# EAGLE design 2 (EAGLE 6.5.0)
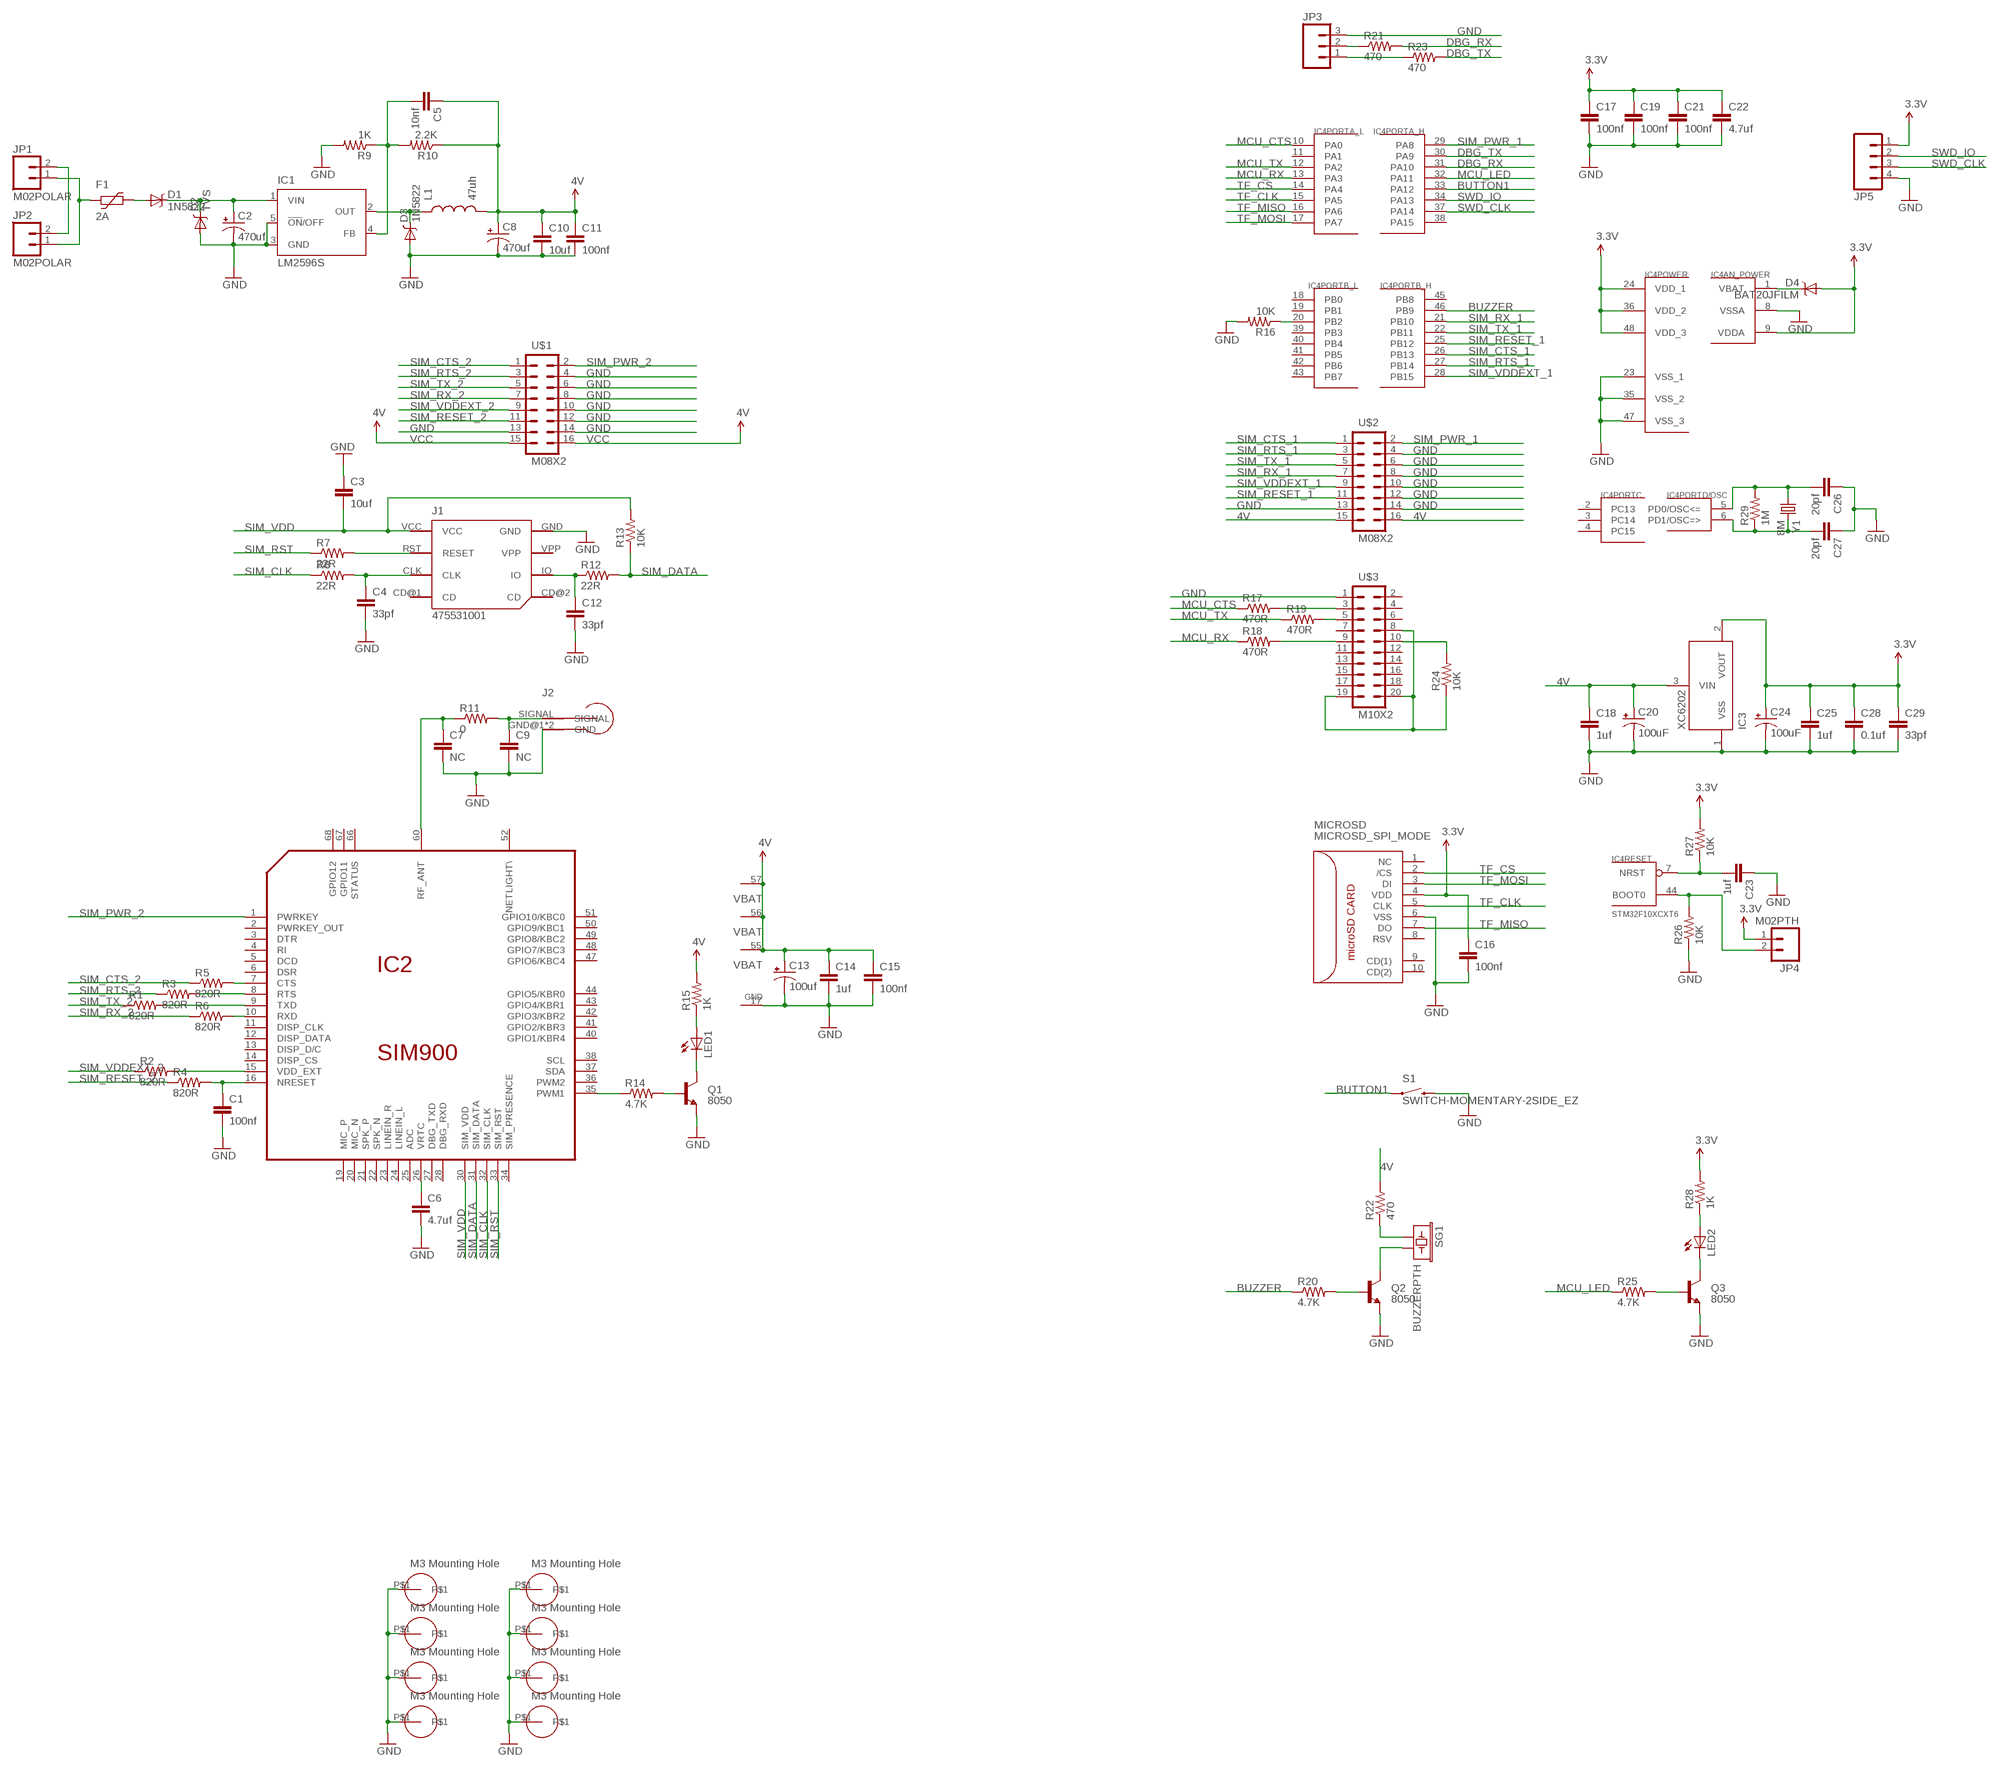
[diagram p0: schematic, sheet 1]

## Parts
C1  100nf  CAP0603-CAP  [0603-CAP]
C2  470uf  CAP_POLPTH4  [CPOL-RADIAL-1000UF-25V]
C3  10uf  CAP0603-CAP  [0603-CAP]
C4  33pf  CAP0603-CAP  [0603-CAP]
C5  10nf  CAP0603-CAP  [0603-CAP]
C6  4.7uf  CAP0603-CAP  [0603-CAP]
C7  NC  CAP0603-CAP  [0603-CAP]
C8  470uf  CAP_POLG  [PANASONIC_G]
C9  NC  CAP0603-CAP  [0603-CAP]
C10  10uf  CAP0603-CAP  [0603-CAP]
C11  100nf  CAP0603-CAP  [0603-CAP]
C12  33pf  CAP0603-CAP  [0603-CAP]
C13  100uf  CAP_POL6032  [EIA6032]
C14  1uf  CAP0603-CAP  [0603-CAP]
C15  100nf  CAP0603-CAP  [0603-CAP]
C16  100nf  CAP0603-CAP  [0603-CAP]
C17  100nf  CAP0603-CAP  [0603-CAP]
C18  1uf  CAP0603-CAP  [0603-CAP]
C19  100nf  CAP0603-CAP  [0603-CAP]
C20  100uF  10UF-20V-10%(TANT)  [EIA3528]
C21  100nf  CAP0603-CAP  [0603-CAP]
C22  4.7uf  CAP0603-CAP  [0603-CAP]
C23  1uf  CAP0603-CAP  [0603-CAP]
C24  100uF  10UF-20V-10%(TANT)  [EIA3528]
C25  1uf  CAP0603-CAP  [0603-CAP]
C26  20pf  CAP0603-CAP  [0603-CAP]
C27  20pf  CAP0603-CAP  [0603-CAP]
C28  0.1uf  CAP0603-CAP  [0603-CAP]
C29  33pf  CAP0603-CAP  [0603-CAP]
D1  1N5822  DIODE-SCHOTTKT-SMB  [SMB-DIODE]
D2  TVS  TVS_SMB  [SMB-DIODE]
D3  1N5822  DIODE-SCHOTTKT-SMB  [SMB-DIODE]
D4  BAT20JFILM  [SOD-323]
F1  2A  PTC-FUSE1812L  [1812L]
IC1  LM2596S  [TO263-5]
IC2  SIM900  [SIM900]
IC3  XC6202  XC6206  [SOT23-3]
IC4  STM32F10XCXT6  [TQFP48]
J1  475531001  [475531001]
J2  IPEX  [IPEX]
JP1  M02POLAR  [MOLEX-1X2]
JP2  M02POLAR  [MOLEX-1X2]
JP3  M03PTH  [1X03]
JP4  M02PTH  [1X02]
JP5  M04PTH  [1X04]
L1  47uh  IHLP4040DZ  [IHLP4040DZ]
LED1  LEDSML0805  [SML0805]
LED2  LED3MM  [LED3MM]
MICROSD  MICROSD_SPI_MODE  [MICRO_SD_CONNECTOR]
Q1  8050  TRANSISTOR_NPNSOT23  [SOT23]
Q2  8050  TRANSISTOR_NPNSOT23  [SOT23]
Q3  8050  TRANSISTOR_NPNSOT23  [SOT23]
R1  820R  RESISTOR0603-RES  [0603-RES]
R2  820R  RESISTOR0603-RES  [0603-RES]
R3  820R  RESISTOR0603-RES  [0603-RES]
R4  820R  RESISTOR0603-RES  [0603-RES]
R5  820R  RESISTOR0603-RES  [0603-RES]
R6  820R  RESISTOR0603-RES  [0603-RES]
R7  22R  1M-1%  [0603-RES]
R8  22R  1M-1%  [0603-RES]
R9  1K  RESISTOR0603-RES  [0603-RES]
R10  2.2K  RESISTOR0603-RES  [0603-RES]
R11  0  1M-1%  [0603-RES]
R12  22R  1M-1%  [0603-RES]
R13  10K  1M-1%  [0603-RES]
R14  4.7K  1M-1%  [0603-RES]
R15  1K  RESISTOR0603-RES  [0603-RES]
R16  10K  1M-1%  [0603-RES]
R17  470R  1M-1%  [0603-RES]
R18  470R  1M-1%  [0603-RES]
R19  470R  1M-1%  [0603-RES]
R20  4.7K  1M-1%  [0603-RES]
R21  470  1M-1%  [0603-RES]
R22  470  1M-1%  [0603-RES]
R23  470  1M-1%  [0603-RES]
R24  10K  1M-1%  [0603-RES]
R25  4.7K  1M-1%  [0603-RES]
R26  10K  RESISTOR0603-RES  [0603-RES]
R27  10K  RESISTOR0603-RES  [0603-RES]
R28  1K  1M-1%  [0603-RES]
R29  1M  1M-1%  [0603-RES]
S1  SWITCH-MOMENTARY-2SIDE_EZ  [TACTILE-PTH-SIDEEZ]
SG1  BUZZERPTH  [BUZZER-12MM]
U$1  M08X2  [2X8]
U$2  M08X2  [2X8]
U$3  M10X2  [2X10]
U$4  M3_MOUNTING_HOLE  [M3_MOUNTING_HOLE]
U$5  M3_MOUNTING_HOLE  [M3_MOUNTING_HOLE]
U$6  M3_MOUNTING_HOLE  [M3_MOUNTING_HOLE]
U$7  M3_MOUNTING_HOLE  [M3_MOUNTING_HOLE]
U$8  M3_MOUNTING_HOLE  [M3_MOUNTING_HOLE]
U$9  M3_MOUNTING_HOLE  [M3_MOUNTING_HOLE]
U$10  M3_MOUNTING_HOLE  [M3_MOUNTING_HOLE]
U$11  M3_MOUNTING_HOLE  [M3_MOUNTING_HOLE]
Y1  8M  CRYSTALHC49US  [HC49US]

## Nets
3.3V: C16.1 C17.1 C19.1 C21.1 C22.1 C24.A(+) C25.1 C28.1 C29.1 D4.2(A) IC3.2(VOUT) IC4.9(AN_POWER:VDDA) IC4.24(POWER:VDD_1) IC4.36(POWER:VDD_2) IC4.48(POWER:VDD_3) JP4.1 JP5.1 MICROSD.4(VDD) R27.2 R28.2
4V: C18.1 C20.A(+) IC3.3(VIN) R22.2 U$2.15 U$2.16
BUTTON1: IC4.33(PORTA_H:PA12) S1.1
BUZZER: IC4.46(PORTB_H:PB9) R20.1
DBG_RX: IC4.31(PORTA_H:PA10) R21.2
DBG_TX: IC4.30(PORTA_H:PA9) R23.2
GND: C1.2 C2.2(-) C3.1 C4.2 C6.2 C7.2 C8.- C9.2 C10.2 C11.2 C12.2 C13.P$2(-) C14.2 C15.2 C16.2 C17.2 C18.2 C19.2 C20.C(-) C21.2 C22.2 C23.1 C24.C(-) C25.2 C26.1 C27.1 C28.2 C29.2 D2.A D3.A IC1.3(GND) IC1.5(!ON!/OFF) IC2.17(GND) IC3.1(VSS) IC4.8(AN_POWER:VSSA) IC4.23(POWER:VSS_1) IC4.35(POWER:VSS_2) IC4.47(POWER:VSS_3) J1.GND J2.GND@1(GND) J2.GND@2(GND) JP3.3 JP5.4 MICROSD.6(VSS) Q1.2(E) Q2.2(E) Q3.2(E) R9.2 R16.2 R26.1 S1.2 U$1.4 U$1.6 U$1.8 U$1.10 U$1.12 U$1.13 U$1.14 U$2.4 U$2.6 U$2.8 U$2.10 U$2.12 U$2.13 U$2.14 U$3.1 U$4.P$1 U$5.P$1 U$6.P$1 U$7.P$1 U$8.P$1 U$9.P$1 U$10.P$1 U$11.P$1
MCU_CTS: IC4.10(PORTA_L:PA0) R17.1
MCU_LED: IC4.32(PORTA_H:PA11) R25.1
MCU_RX: IC4.13(PORTA_L:PA3) R18.1
MCU_TX: IC4.12(PORTA_L:PA2) R19.1
N$1: D4.1(C) IC4.1(AN_POWER:VBAT)
N$2: C26.2 IC4.5(PORTD/OSC:PD0/OSC<=) R29.2 Y1.1
N$3: C27.2 IC4.6(PORTD/OSC:PD1/OSC=>) R29.1 Y1.2
N$4: C23.2 IC4.7(RESET:NRST) R27.1
N$5: IC4.44(RESET:BOOT0) JP4.2 R26.2
N$6: R24.1 U$3.8 U$3.19 U$3.20
N$7: JP1.2 JP2.2
N$8: D3.C IC1.2(OUT) L1.P$1
N$9: C2.1(+) D1.C D2.C IC1.1(VIN)
N$10: F1.P$1 JP1.1 JP2.1
N$11: C5.2 IC1.4(FB) R9.1 R10.2
N$12: R17.2 U$3.3
N$13: R19.2 U$3.5
N$14: LED1.C Q1.3(C)
N$15: R24.2 U$3.10
N$16: C7.1 IC2.60(RF_ANT) R11.1
N$17: IC4.20(PORTB_L:PB2) R16.1
N$18: C9.1 J2.SIGNAL R11.2
N$19: D1.A F1.P$2
N$20: IC2.15(VDD_EXT) R2.2
N$21: IC2.35(PWM1) R14.1
N$22: Q1.1(B) R14.2
N$23: LED1.A R15.1
N$24: J1.RST(RESET) R7.2
N$25: C6.1 IC2.26(VRTC)
N$27: Q3.1(B) R25.2
N$29: C1.1 IC2.16(NRESET) R4.2
N$30: IC2.7(CTS) R5.2
N$33: IC2.8(RTS) R3.2
N$34: IC2.9(TXD) R1.2
N$35: C12.1 J1.IO R12.1
N$36: IC2.10(RXD) R6.2
N$37: JP3.2 R21.1
N$38: JP3.1 R23.1
N$39: C4.1 J1.CLK R8.2
N$57: Q2.1(B) R20.2
N$58: R22.1 SG1.+
N$59: Q2.3(C) SG1.-
N$60: R18.2 U$3.9
N$61: LED2.A R28.1
N$62: LED2.K(C) Q3.3(C)
SIM_CLK: IC2.32(SIM_CLK) R8.1
SIM_CTS_1: IC4.26(PORTB_H:PB13) U$2.1
SIM_CTS_2: R5.1 U$1.1
SIM_DATA: IC2.31(SIM_DATA) R12.2 R13.1
SIM_PWR_1: IC4.29(PORTA_H:PA8) U$2.2
SIM_PWR_2: IC2.1(PWRKEY) U$1.2
SIM_RESET_1: IC4.25(PORTB_H:PB12) U$2.11
SIM_RESET_2: R4.1 U$1.11
SIM_RST: IC2.33(SIM_RST) R7.1
SIM_RTS_1: IC4.27(PORTB_H:PB14) U$2.3
SIM_RTS_2: R3.1 U$1.3
SIM_RX_1: IC4.21(PORTB_H:PB10) U$2.7
SIM_RX_2: R6.1 U$1.7
SIM_TX_1: IC4.22(PORTB_H:PB11) U$2.5
SIM_TX_2: R1.1 U$1.5
SIM_VDD: C3.2 IC2.30(SIM_VDD) J1.VCC R13.2
SIM_VDDEXT_1: IC4.28(PORTB_H:PB15) U$2.9
SIM_VDDEXT_2: R2.1 U$1.9
SWD_CLK: IC4.37(PORTA_H:PA14) JP5.3
SWD_IO: IC4.34(PORTA_H:PA13) JP5.2
TF_CLK: IC4.15(PORTA_L:PA5) MICROSD.5(CLK)
TF_CS: IC4.14(PORTA_L:PA4) MICROSD.2(/CS)
TF_MISO: IC4.16(PORTA_L:PA6) MICROSD.7(DO)
TF_MOSI: IC4.17(PORTA_L:PA7) MICROSD.3(DI)
VCC: C5.1 C8.+ C10.1 C11.1 C13.P$1(+) C14.1 C15.1 IC2.55(VBAT) IC2.56(VBAT) IC2.57(VBAT) L1.P$2 R10.1 R15.2 U$1.15 U$1.16 ; supply symbol labelled 4V
Unconnected: IC2.2(PWRKEY_OUT) IC2.3(DTR) IC2.4(RI) IC2.5(DCD) IC2.6(DSR) IC2.11(DISP_CLK) IC2.12(DISP_DATA) IC2.13(DISP_D/C) IC2.14(DISP_CS) IC2.19(MIC_P) IC2.20(MIC_N) IC2.21(SPK_P) IC2.22(SPK_N) IC2.23(LINEIN_R) IC2.24(LINEIN_L) IC2.25(ADC) IC2.27(DBG_TXD) IC2.28(DBG_RXD) IC2.34(SIM_PRESENCE) IC2.36(PWM2) IC2.37(SDA) IC2.38(SCL) IC2.40(GPIO1/KBR4) IC2.41(GPIO2/KBR3) IC2.42(GPIO3/KBR2) IC2.43(GPIO4/KBR1) IC2.44(GPIO5/KBR0) IC2.47(GPIO6/KBC4) IC2.48(GPIO7/KBC3) IC2.49(GPIO8/KBC2) IC2.50(GPIO9/KBC1) IC2.51(GPIO10/KBC0) IC2.52(NETLIGHT\) IC2.66(STATUS) IC2.67(GPIO11) IC2.68(GPIO12) IC4.2(PORTC:PC13) IC4.3(PORTC:PC14) IC4.4(PORTC:PC15) IC4.11(PORTA_L:PA1) IC4.18(PORTB_L:PB0) IC4.19(PORTB_L:PB1) IC4.38(PORTA_H:PA15) IC4.39(PORTB_L:PB3) IC4.40(PORTB_L:PB4) IC4.41(PORTB_L:PB5) IC4.42(PORTB_L:PB6) IC4.43(PORTB_L:PB7) IC4.45(PORTB_H:PB8) J1.CD@1(CD) J1.CD@2(CD) J1.VPP MICROSD.1(NC) MICROSD.8(RSV) MICROSD.9(CD(1)) MICROSD.10(CD(2)) U$3.2 U$3.4 U$3.6 U$3.7 U$3.11 U$3.12 U$3.13 U$3.14 U$3.15 U$3.16 U$3.17 U$3.18

## Power pins joined to a net without a drawn wire
GND: IC2.18(GND) IC2.29(GND) IC2.39(GND) IC2.45(GND) IC2.46(GND) IC2.53(GND) IC2.54(GND) IC2.58(GND) IC2.59(GND) IC2.61(GND) IC2.62(GND) IC2.63(GND) IC2.64(GND) IC2.65(GND)

## Library data of the parts
C1 C3-C7 C9-C12 C14-C19 C21-C23 C25-C29 = SparkFun-Passives:CAP: Capacitor Standard 0603 ceramic capacitor, and 0.1" leaded capacitor.
C2 C8 = SparkFun-Capacitors:CAP_POL: Capacitor Polarized These are standard SMD and PTH capacitors. Normally 10uF, 47uF, and 100uF in electrolytic and tantalum varieties. Always verify the external diameter of the through hole cap, it varies with capacity, voltage, and manufacturer. The EIA devices should be standard.
C13 = SparkFun-Passives:CAP_POL: Capacitor Polarized These are standard SMD and PTH capacitors. Normally 10uF, 47uF, and 100uF in electrolytic and tantalum varieties. Always verify the external diameter of the through hole cap, it varies with capacity, voltage, and manufacturer. The EIA devices should be standard.
C20 C24 = SparkFun-Capacitors:10UF-20V-10%(TANT): CAP-08063; PROD_ID: CAP-08063; VALUE: 10uF
D1 D3 = SparkFun-DiscreteSemi:DIODE-SCHOTTKT-SMB
D2 = SparkFun-DiscreteSemi:TVS_SMB
D4 = SparkFun-DiscreteSemi:BAT20JFILM: 23V, 1A Schottky diode, SOD-323 package; PROD_ID: DIO-11623
F1 = digital-toy:PTC-FUSE
IC1 = national-semiconductor:LM2596: SIMPLE SWITCHER® Power Converter 150 kHz 3A Step-Down Voltage Regulator Source: http://www.national.com/ds/LM/LM2596.pdf
IC2 = sim900:SIM900
IC3 = SparkFun-PowerIC:XC6206: Low ESR Cap. Compatible Positive Voltage Regulator
IC4 = stm32:STM32F10XCXT6: ST STM32F101/103 48pin LQFP
J1 = simcard:475531001: MOLEX SIM Card Holder 47553-1001 1.27mm Pitch SIM Card Holder with 2 Detect Pins, 6 Circuits, Push-Push Style, Housing Height 1.80mm, with Pegs, Lead-Free
J2 = SparkFun-RF:IPEX
JP1 JP2 JP4 = SparkFun-Connectors:M02: Standard 2-pin 0.1" header. Use with - straight break away headers ( PRT-00116) - right angle break away headers (PRT-00553) - swiss pins (PRT-00743) - machine pins (PRT-00117) - female headers (PRT-00115) Molex polarized connector foot print use with: PRT-08233 with associated crimp pins and housings. 2.54_SCREWTERM for use with PRT-10571. 3.5mm Screw Terminal footprints for PRT-08084 5mm Screw Terminal footprints for use with PRT-08433
JP3 = SparkFun-Connectors:M03: Header 3 Standard 3-pin 0.1" header. Use with straight break away headers (SKU : PRT-00116), right angle break away headers (PRT-00553), swiss pins (PRT-00743), machine pins (PRT-00117), and female headers (PRT-00115). Molex polarized connector foot print use with SKU : PRT-08232 with associated crimp pins and housings.
JP5 = SparkFun-Connectors:M04: Header 4 Standard 4-pin 0.1" header. Use with straight break away headers (SKU : PRT-00116), right angle break away headers (PRT-00553), swiss pins (PRT-00743), machine pins (PRT-00117), and female headers (PRT-00115). Molex polarized connector foot print use with SKU : PRT-08231 with associated crimp pins and housings. 1MM SMD Version SKU: PRT-10208
L1 = SparkFun-Passives:IHLP4040DZ
LED1 = led:LED: LED OSRAM: - CHIPLED LG R971, LG N971, LY N971, LG Q971, LY Q971, LO R971, LY R971 LH N974, LH R974 LS Q976, LO Q976, LY Q976 LO Q996 - Hyper CHIPLED LW Q18S LB Q993, LB Q99A, LB R99A - SideLED LS A670, LO A670, LY A670, LG A670, LP A670 LB A673, LV A673, LT A673, LW A673 LH A674 LY A675 LS A676, LA A676, LO A676, LY A676, LW A676 LS A679, LY A679, LG A679 - Hyper Micro SIDELED® LS Y876, LA Y876, LO Y876, LY Y876 LT Y87S - SmartLED LW L88C, LW L88S LB L89C, LB L89S, LG L890 LS L89K, LO L89K, LY L89K LS L896, LA L896, LO L896, LY L896 - TOPLED LS T670, LO T670, LY T670, LG T670, LP T670 LSG T670, LSP T670, LSY T670, LOP T670, LYG T670 LG T671, LOG T671, LSG T671 LB T673, LV T673, LT T673, LW T673 LH T674 LS T676, LA T676, LO T676, LY T676, LB T676, LH T676, LSB T676, LW T676 LB T67C, LV T67C, LT T67C, LS T67K, LO T67K, LY T67K, LW E67C LS E67B, LA E67B, LO E67B, LY E67B, LB E67C, LV E67C, LT E67C LW T67C LS T679, LY T679, LG T679 LS T770, LO T770, LY T770, LG T770, LP T770 LB T773, LV T773, LT T773, LW T773 LH T774 LS E675, LA E675, LY E675, LS T675 LS T776, LA T776, LO T776, LY T776, LB T776 LHGB T686 LT T68C, LB T68C - Hyper Mini TOPLED® LB M676 - Mini TOPLED Santana® LG M470 LS M47K, LO M47K, LY M47K Source: http://www.osram.convergy.de LUXEON: - LUMILED® LXK2-PW12-R00, LXK2-PW12-S00, LXK2-PW14-U00, LXK2-PW14-V00 LXK2-PM12-R00, LXK2-PM12-S00, LXK2-PM14-U00 LXK2-PE12-Q00, LXK2-PE12-R00, LXK2-PE12-S00, LXK2-PE14-T00, LXK2-PE14-U00 LXK2-PB12-K00, LXK2-PB12-L00, LXK2-PB12-M00, LXK2-PB14-N00, LXK2-PB14-P00, LXK2-PB14-Q00 LXK2-PR12-L00, LXK2-PR12-M00, LXK2-PR14-Q00, LXK2-PR14-R00 LXK2-PD12-Q00, LXK2-PD12-R00, LXK2-PD12-S00 LXK2-PH12-R00, LXK2-PH12-S00 LXK2-PL12-P00, LXK2-PL12-Q00, LXK2-PL12-R00 Source: www.luxeon.com KINGBRIGHT: KA-3528ASYC Source: www.kingbright.com
LED2 = SparkFun-LED:LED: LEDs Standard schematic elements and footprints for 5mm, 3mm, 1206, and 0603 sized LEDs. 5mm - Spark Fun Electronics SKU : COM-00529 (and others)
MICROSD = con-molex-microsd:MICROSD_SPI_MODE: MOLEX - 49225-0821 - CONNECTEUR MICRO SD PUSH/PUSH REV Fabricant: MOLEX Code commande Farnell: 1366700 <http://fr.farnell.com/molex/49225-0821/connecteur-micro-sd-push-push-rev/dp/1366700?Ntt=1366700> Référence fabricant: 49225-0821
Q1-Q3 = SparkFun-DiscreteSemi:TRANSISTOR_NPN: Generic NPN BJT MMBT2222A - TRANS-08049 (SOT-23, 1A 40V) MPSA42 - TRANS-09116 (SOT-23, 500mA 300V) MMBT5088LT1G - TRANS-11160 (SOT-23, 50 mA 30V)
R1-R6 R9 R10 R15 R26 R27 = SparkFun-Passives:RESISTOR: Resistor Basic schematic elements and footprints for 0603, 1206, and PTH resistors.
R7 R8 R11-R14 R16-R25 R28 = SparkFun-Resistors:1M-1%: 1M-ohm SMT 1/10W - 1% (0603) RES-07868; PROD_ID: RES-07868; VALUE: 1M
R29 = SparkFun-Resistors:1M-1%: 1M-ohm SMT 1/10W - 1% (0603) RES-07868; PROD_ID: RES-07868
S1 = SparkFun-Electromechanical:SWITCH-MOMENTARY-2: Various NO switches- pushbuttons, reed, etc
SG1 = SparkFun-Electromechanical:BUZZER: Buzzer 12mm Spark Fun Electronics SKU : Comp-Buzzer
U$1 U$2 = SparkFun-Connectors:M08X2: .1" headers, two rows of 8 each
U$3 = SparkFun-Connectors:M10X2: This was SPECIALLY designed to be used with our Graphic LCD Backpack. Be sure you want to use this! It is not only staggered on each line of header holes, but IT IS ALSO offset of the center point of the top and bottom lines by 5 mil. This causes the headers to lock into place on the "standard" footprint on the LCD screen. The extra squares on the tdocu layer are there simply to reference other pins (if you were to actually populate a longer header than ten long - this is what we do with the backpacks).
U$4-U$11 = SparkFun-Aesthetics:M3_MOUNTING_HOLE
Y1 = SparkFun-FreqCtrl:CRYSTAL: Various standard crystals. Proven footprints. Spark Fun Electronics SKU : COM-00534

## Board
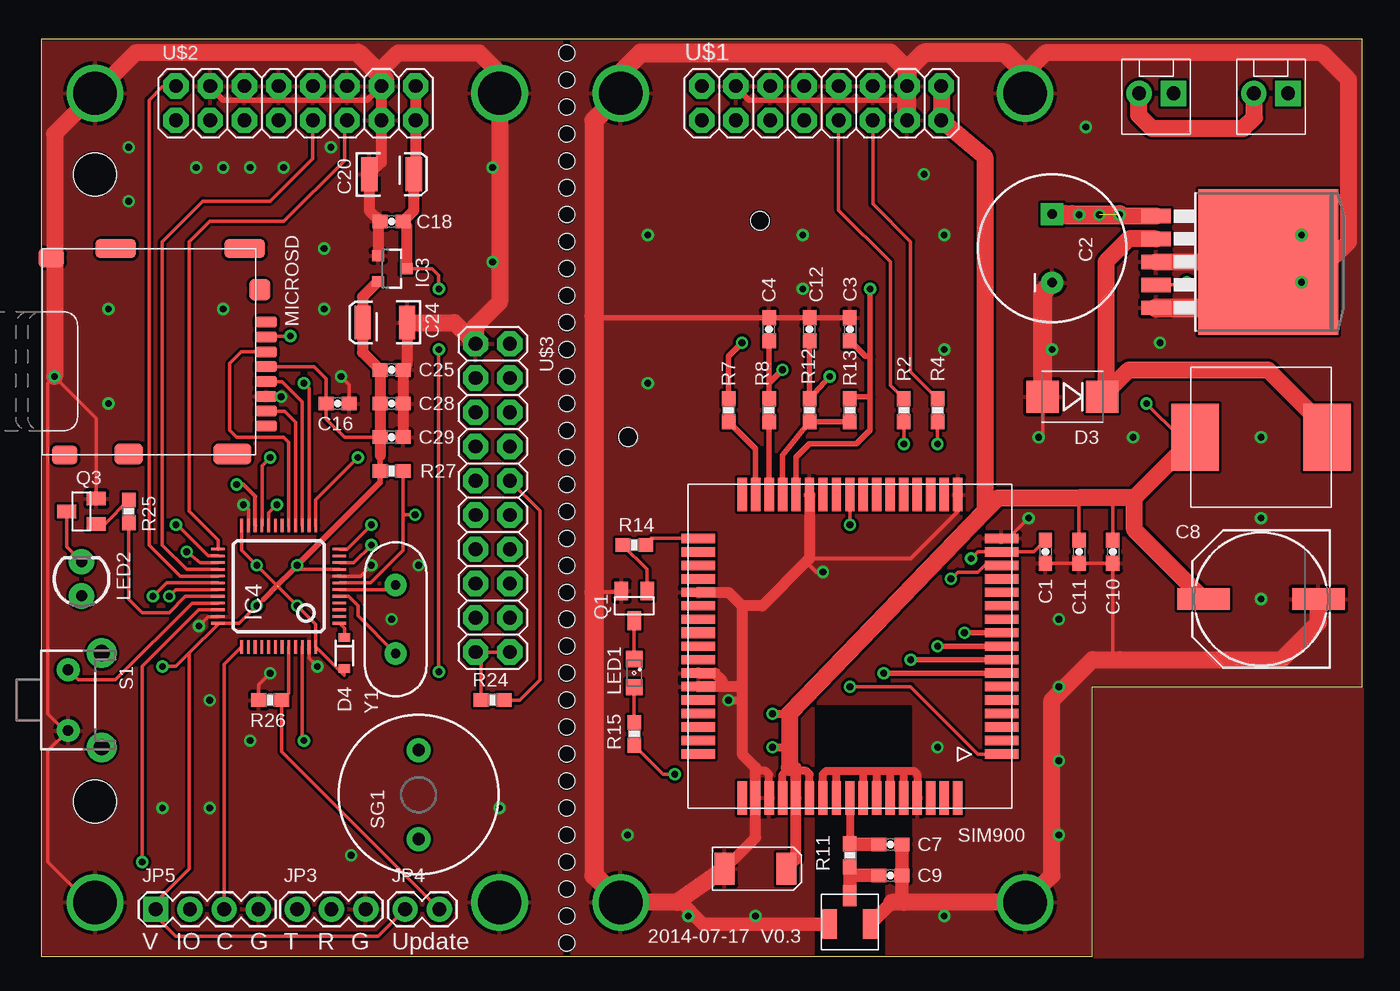
[diagram p1: board, top side]
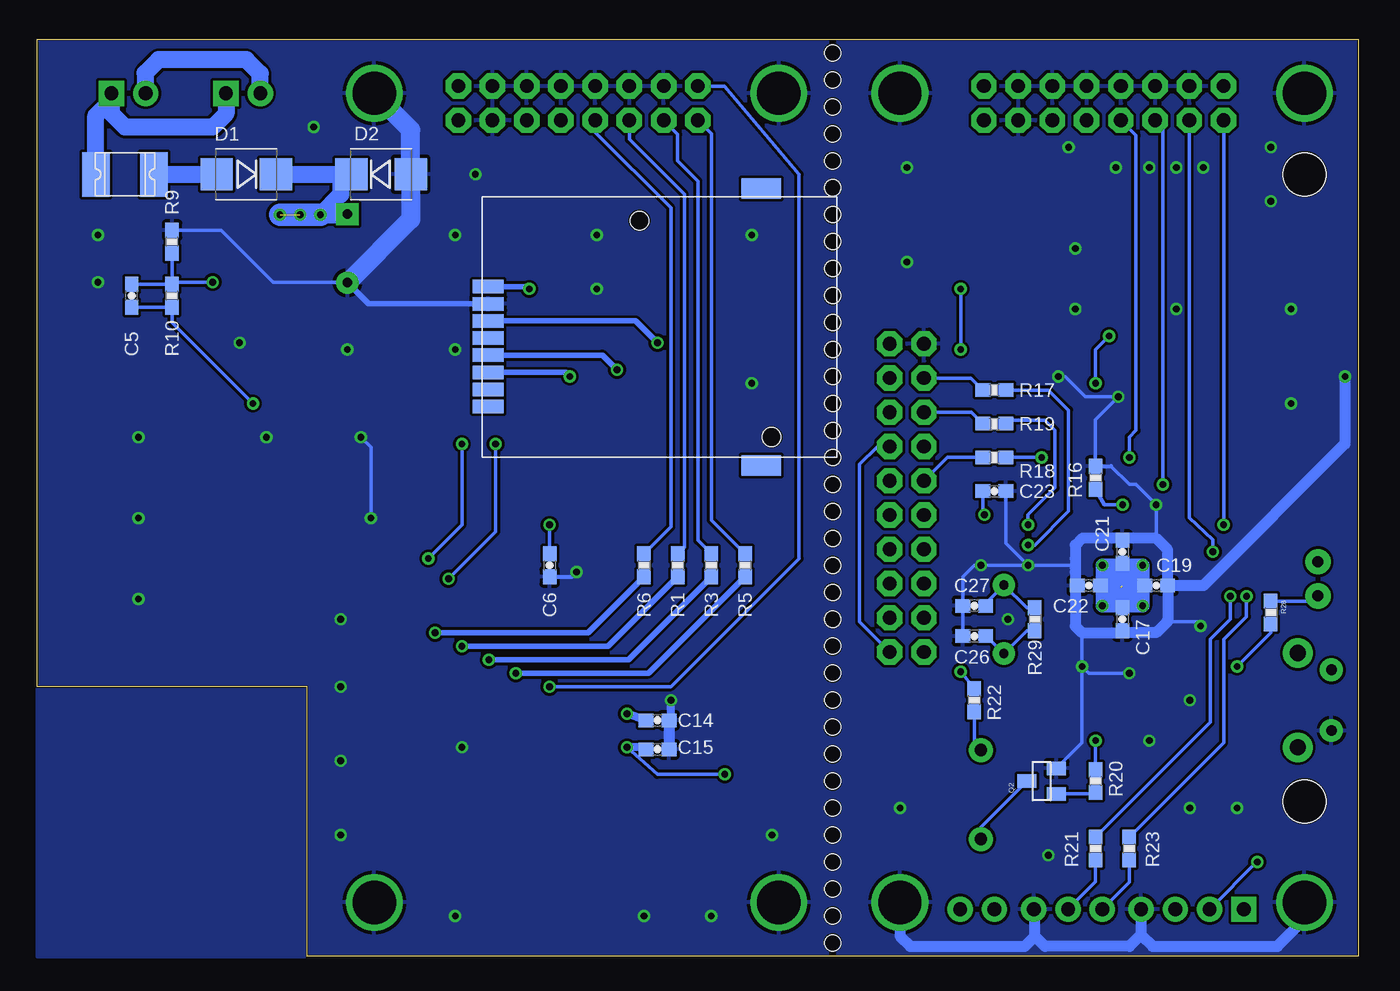
[diagram p2: board, bottom side, seen from below]

Size 98 x 68 mm. Coordinates in mm from the lower left corner, seen from the top.
Outline: 98,68 0,68 0,0 78,0 78,20 98,20 98,68
Copper layers (1*16): Top 0.035mm / dielectric 1.5mm / Bottom 0.035mm
Design rules "default *": minimum track width 10mil, minimum drill 14mil, track to track 8mil, track to pad 8mil, pad to pad 8mil, via to via 8mil, smd to smd 8mil, copper to edge 0.1mm, drill to drill 8mil, minimum pad ring 10mil, minimum via ring 8mil, stop-mask expansion 4mil, vias tented up to drill 0mil, thermal gap 10mil
Holes 1.2 mm at 39,67 39,65 39,63 39,61 39,59 39,57 39,55 39,53 39,51 39,41 39,39 39,37 39,35 39,33 39,31 39,29 39,27 39,25 39,23 39,21 39,19 39,17 39,15 39,49 39,47 39,45 39,43 39,13 39,11 39,9 39,7 39,5 39,3 39,1
Holes 3.2 mm at 4,58 4,11.5

### Footprints (pad centres in the part's own frame; a part is rotated, then mirrored left to right if it is on the bottom)
0603-CAP = smd 1.1 x 1: 1 -0.85,0; 2 0.85,0
CPOL-RADIAL-1000UF-25V = drill 0.7 pad 1.651 square: 1 2.54,0 | drill 0.7 pad 1.651: 2 -2.54,0
PANASONIC_G = smd 3.9 x 1.6: + 4.25,0; - -4.25,0
EIA6032 = smd 1.5 x 2.4: P$1 -2.3,0; P$2 2.3,0
EIA3528 = smd 1.2 x 2.5: A 1.65,0; C -1.65,0
SMB-DIODE = smd 2.4 x 2.4: A 2.2,0; C -2.2,0
SOD-323 = smd 0.63 x 0.83: 1 -1.15,0; 2 1.15,0
1812L = smd 2.03 x 3.3: P$1 -2.16,0; P$2 2.16,0
TO263-5 = smd 1.067 x 2.159: 1 -3.404,-5.791; 2 -1.702,-5.791; 3 0,-5.791; 4 1.702,-5.791; 5 3.404,-5.791 | smd 10.8 x 10.41: 6 0,2.54
SIM900 = smd 2.5 x 0.698: 1 -11.25,8; 2 -11.25,7; 3 -11.25,6; 4 -11.25,5; 5 -11.25,4; 6 -11.25,3; 7 -11.25,2; 8 -11.25,1; 9 -11.25,0; 10 -11.25,-1; 11 -11.25,-2; 12 -11.25,-3; 13 -11.25,-4; 14 -11.25,-5; 15 -11.25,-6; 16 -11.25,-7; 17 -11.25,-8; 35 11.25,-8; 36 11.25,-7; 37 11.25,-6; 38 11.25,-5; 39 11.25,-4; 40 11.25,-3; 41 11.25,-2; 43 11.25,0; 44 11.25,1; 45 11.25,2; 46 11.25,3; 47 11.25,4; 48 11.25,5; 49 11.25,6; 50 11.25,7; 51 11.25,8 | smd 0.698 x 2.5: 18 -8,-11.25; 19 -7,-11.25; 20 -6,-11.25; 21 -5,-11.25; 22 -4,-11.25; 23 -3,-11.25; 24 -2,-11.25; 25 -1,-11.25; 26 0,-11.25; 27 1,-11.25; 28 2,-11.25; 29 3,-11.25; 30 4,-11.25; 31 5,-11.25; 32 6,-11.25; 33 7,-11.25; 34 8,-11.25; 52 8,11.25; 53 7,11.25; 54 6,11.25; 55 5,11.25; 56 4,11.25; 57 3,11.25; 58 2,11.25; 59 1,11.25; 60 0,11.25; 61 -1,11.25; 62 -2,11.25; 63 -3,11.25; 64 -4,11.25; 65 -5,11.25; 66 -6,11.25; 67 -7,11.25; 68 -8,11.25 | smd 2.5 x 0.8: 42 11.25,-1
SOT23-3 = smd 0.8 x 0.9: 1 -0.95,-1; 2 0.95,-1; 3 0,1.1
TQFP48 = smd 0.2 x 1: 1 -2.75,-4.5; 2 -2.25,-4.5; 3 -1.75,-4.5; 4 -1.25,-4.5; 5 -0.75,-4.5; 6 -0.25,-4.5; 7 0.25,-4.5; 8 0.75,-4.5; 9 1.25,-4.5; 10 1.75,-4.5; 11 2.25,-4.5; 12 2.75,-4.5; 25 2.75,4.5; 26 2.25,4.5; 27 1.75,4.5; 28 1.25,4.5; 29 0.75,4.5; 30 0.25,4.5; 31 -0.25,4.5; 32 -0.75,4.5; 33 -1.25,4.5; 34 -1.75,4.5; 35 -2.25,4.5; 36 -2.75,4.5 | smd 1 x 0.2: 13 4.5,-2.75; 14 4.5,-2.25; 15 4.5,-1.75; 16 4.5,-1.25; 17 4.5,-0.75; 18 4.5,-0.25; 19 4.5,0.25; 20 4.5,0.75; 21 4.5,1.25; 22 4.5,1.75; 23 4.5,2.25; 24 4.5,2.75; 37 -4.5,2.75; 38 -4.5,2.25; 39 -4.5,1.75; 40 -4.5,1.25; 41 -4.5,0.75; 42 -4.5,0.25; 43 -4.5,-0.25; 44 -4.5,-0.75; 45 -4.5,-1.25; 46 -4.5,-1.75; 47 -4.5,-2.25; 48 -4.5,-2.75
475531001 = smd 2.3 x 1: CD@1 0.45,3.77; CD@2 0.45,5.04; CLK 0.45,7.58; GND 0.45,11.39; IO 0.45,6.31; RST 0.45,10.12; VCC 0.45,12.66; VPP 0.45,8.85 | smd 2.95 x 1.5: P$9 20.7,-0.6; P$10 20.7,19.95 | hole 1.4: 11.67,17.56; 21.47,1.51
IPEX = smd 2.2 x 1.05: GND@1 -0.1,1.5; GND@2 -0.1,-1.5 | smd 1.55 x 1: SIGNAL 2,0
MOLEX-1X2 = drill 1.016 pad 1.88 square: 1 0,0 | drill 1.016 pad 1.88: 2 2.54,0
1X03 = drill 1.016 pad 1.88: 1 0,0; 2 2.54,0; 3 5.08,0
1X02 = drill 1.016 pad 1.88: 1 0,0; 2 2.54,0
1X04 = drill 1.016 pad 1.88 square: 1 0,0 | drill 1.016 pad 1.88: 2 2.54,0; 3 5.08,0; 4 7.62,0
IHLP4040DZ = smd 3.5 x 5: P$1 -4.9,0; P$2 4.9,0
SML0805 = smd 1.2 x 1.2: A 1.05,0; C -1.05,0
LED3MM = drill 0.813 pad 1.88: A -1.27,0; K 1.27,0
MICRO_SD_CONNECTOR = smd 0.8 x 1.6: 1 -2.03,8.2; 2 -0.93,8.2; 3 0.17,8.2; 4 1.27,8.2; 5 2.37,8.2; 6 3.47,8.2; 7 4.57,8.2; 8 5.67,8.2 | smd 1.55 x 2.8: 9 7.735,5.7 | smd 1.55 x 2.1: 10 7.735,-2 | smd 1.4 x 1.9: 11 7.81,-6.75; 12 -6.79,-7.75 | smd 1.4 x 3: 13 -7.49,-2.95; 14 -7.49,6.6 | smd 1.6 x 1.55: 15 -4.43,7.725
SOT23 = smd 1 x 1.4: 1 -0.95,-1.1; 2 0.95,-1.1; 3 0,1.1
0603-RES = smd 1.1 x 1: 1 -0.85,0; 2 0.85,0
TACTILE-PTH-SIDEEZ = drill 0.8 pad 1.7: 1 -2.25,0; 2 2.25,0 | drill 1.2 pad 2.2: ANCHOR1 -3.5,2.5; ANCHOR2 3.5,2.5
BUZZER-12MM = drill 0.9 pad 1.778: + 3.3,0; - -3.3,0
2X8 = drill 1.016 pad 1.88 octagon: 1 0,0; 2 0,2.54; 3 2.54,0; 4 2.54,2.54; 5 5.08,0; 6 5.08,2.54; 7 7.62,0; 8 7.62,2.54; 9 10.16,0; 10 10.16,2.54; 11 12.7,0; 12 12.7,2.54; 13 15.24,0; 14 15.24,2.54; 15 17.78,0; 16 17.78,2.54
2X10 = drill 1.016 pad 1.88 octagon: 1 -11.43,-1.27; 2 -11.43,1.27; 3 -8.89,-1.27; 4 -8.89,1.27; 5 -6.35,-1.27; 6 -6.35,1.27; 7 -3.81,-1.27; 8 -3.81,1.27; 9 -1.27,-1.27; 10 -1.27,1.27; 11 1.27,-1.27; 12 1.27,1.27; 13 3.81,-1.27; 14 3.81,1.27; 15 6.35,-1.27; 16 6.35,1.27; 17 8.89,-1.27; 18 8.89,1.27; 19 11.43,-1.27; 20 11.43,1.27
M3_MOUNTING_HOLE = drill 3.2: P$1 0,0
HC49US = drill 0.7 pad 1.651: 1 -2.54,0; 2 2.54,0

### Placement (x,y rotation side)
C1  74.5,30 270 top
C2  75,52.5 90 top
C3  60,46.5 270 top
C4  54,46.5 90 top
C5  91,49 90 bottom
C6  60,29 270 bottom
C7  63,8.3 0 top
C8  90.5,26.5 180 top
C9  63,6 0 top
C10  79.5,30 270 top
C11  77,30 270 top
C12  57,46.5 90 top
C13  53,6.5 180 top
C14  52,17.5 0 bottom
C15  52,15.35 0 bottom
C16  22,41 0 top
C17  17.5,25 270 bottom
C18  26,54.5 180 top
C19  15,27.5 0 bottom
C20  26,58 0 top
C21  17.5,30 90 bottom
C22  20,27.5 180 bottom
C23  27,34.5 180 bottom
C24  25.5,47 180 top
C25  26,43.5 0 top
C26  28.5,23.75 0 bottom
C27  28.5,26 0 bottom
C28  26,41 0 top
C29  26,38.5 0 top
D1  82.5,58 180 bottom
D2  72.5,58 0 bottom
D3  76.5,41.5 180 top
D4  22.5,22.5 270 top
F1  91.5,58 0 bottom
IC1  88.5,51.5 270 top
IC2  60,23 180 top
IC3  26,51 270 top
IC4  17.63,27.45 90 top
J1  65,37 0 bottom
J2  60,2.5 90 top
JP1  84,64 180 top
JP2  92.5,64 180 top
JP3  19,3.5 0 top
JP4  27,3.5 0 top
JP5  8.5,3.5 0 top
L1  90.5,38.5 180 top
LED1  44,21 270 top
LED2  3,28 90 top
MICROSD  8.5,45 270 top
Q1  44,26 180 top
Q2  23.5,13 90 bottom
Q3  3,33 90 top
R1  50.5,29 270 bottom
R2  64,40.5 270 top
R3  48,29 270 bottom
R4  66.5,40.5 270 top
R5  45.5,29 270 bottom
R6  53,29 270 bottom
R7  51,40.5 90 top
R8  54,40.5 90 top
R9  88,53 90 bottom
R10  88,49 90 bottom
R11  60,7.5 270 top
R12  57,40.5 270 top
R13  60,40.5 90 top
R14  44,30.5 180 top
R15  44,16.5 270 top
R16  19.5,35.5 90 bottom
R17  27,42 180 bottom
R18  27,37 180 bottom
R19  27,39.5 180 bottom
R20  19.5,13 270 bottom
R21  19.5,8 90 bottom
R22  28.5,19 90 bottom
R23  17,8 90 bottom
R24  33.5,19 0 top
R25  6.5,33 90 top
R26  17,19 0 top
R27  26,36 180 top
R28  6.5,25.5 270 bottom
R29  24,25 270 bottom
S1  2,19 270 top
SG1  28,12 90 top
U$1  49,62 0 top
U$2  10,62 0 top
U$3  33.5,34 270 top
U$4  4,64 0 top
U$5  4,4 0 top
U$6  34,64 0 top
U$7  34,4 0 top
U$8  43,64 0 top
U$9  73,64 0 top
U$10  43,4 0 top
U$11  73,4 0 top
Y1  26.3,25 90 top

### Tracks (layer width: path | path; a pad name or v marks a point on that pad's centre or on a via)
3.3V  (via drill 0.5)  (1 unrouted)
  Top 0.254: IC4.24 14.88,30.12 v16,29 17.62,27.38 | IC4.9 18.7,28.7 18.5,28.5 | 16.5,26.5 v16,26 14.7,24.7 IC4.36 13.13,24.63 11,22.5 | 17.62,27.38 v19,26 20.38,24.62 IC4.48 22.48,20.85 D4.2 | C29.1 22.5,38.5 21.15,39.85 C16.1 21.15,42.85 20.27,43.73 MICROSD.4 | 17.62,27.38 17.62,27.62 | 11,22.5 11,6.5 8.5,4 JP5.1 8.5,3 10,1.5 25,1.5 JP4.1 | v9,21.5 10,21.5 11,22.5
  Top 0.406: 16.5,26.5 17.62,27.62 18.5,28.5 v19,29 25.15,35.15 R27.2 25.15,37.15
  Top 0.813: IC3.2 23.85,48.9 C24.A 23.85,44.8 C25.1 C28.1 C29.1 25.15,37.15
  Bottom 0.254: R28.2 6.5,24 v9,21.5
  Bottom 0.813: C19.1 15.88,27.5 | 17.5,29.12 C21.1 | C22.1 19.25,27.5 | 17.5,25.75 C17.1
  Bottom 1.016: C19.1 16,27.5 | 16,27.5 v16,26 17.35,26 C17.1 | C21.1 17.35,29 v16,29 16,27.5 | C22.1 19,27.35 v19,26 17.5,26 | 16.75,28.75 16.75,26.75 18.25,26.75 18.25,28.25 17.5,28.25 17.5,27.5 | 17.5,29 v19,29 19,27.75
4V  (via drill 0.5)
  Top 0.254: v29.5,21.1 v29.5,45 | v29.5,49.5 29.5,50.5 29,51 IC3.3
  Top 0.61: C18.1 27.1,54.25 | 27.78,58.13 C20.A
  Top 0.813: C20.A 27.65,55.3 C18.1 | 27.1,54.25 IC3.3 | U$2.16 U$2.15 27.78,58.13
  Bottom 0.254: v29.5,21.1 R22.2 | v29.5,45 v29.5,49.5
BUTTON1
  Top 0.254: IC4.33 11.2,26.2 5.5,20.5 2.75,20.5 S1.1
BUZZER  (via drill 0.5)
  Top 0.254: v19.5,16 19.38,16.12 IC4.46
  Bottom 0.254: R20.1 v19.5,16
DBG_RX  (via drill 0.5)
  Top 0.254: IC4.31 10,27.2 v9.5,26.7
  Bottom 0.254: R21.2 11,17.35 11,23.5 9.5,25 v9.5,26.7
DBG_TX  (via drill 0.5)
  Top 0.254: IC4.30 9.3,27.7 v8.3,26.7
  Bottom 0.254: R23.2 10,15.85 10,23.5 8.3,25.2 v8.3,26.7
GND  (via drill 0.5)
  Top 0.254: v74,38.5 74.3,38.8 D3.A | IC4.47 19.88,22.12 v20.5,21.5 | IC4.23 15.38,33.12 v15,33.5 | 22.7,28.2 IC4.8 23.7,28.2 v24.5,29 | MICROSD.6 17.47,41.53 v17.8,41.5 | C16.2 22.85,42.4 v22.25,43 | 79.5,22.5 80,22 | C1.2 C11.2 C10.2 79.5,22 | U$5.P$1 3.5,4 0.5,7 0.5,15.25 S1.2 1.75,16.75 0.5,18 0.5,42.5 v1,43 4.1,39.9 Q3.2 | R26.1 16.15,20.15 v17,21 | IC4.35 12.4,25.2 v11.7,24.5 | IC2.17 71.75,31 v73.25,32.5
  Top 0.305: Q1.2 42.95,27 41,27 | IC2.18 68,33 64.5,29.5 57,29.5 | v58,28.5 57.5,28.5 56.75,29.25
  Top 0.406: C4.2 C12.2 C3.1 41.15,47.35 41,47.5 | U$2.4 12.54,64.46 13.5,63.5 15,63.5 | 15,63.5 17.5,63.5 | 17.5,63.5 20,63.5 | 20,63.5 22.5,63.5 | 22.5,63.5 24.2,63.5 U$2.14 | U$2.6 15.08,63.58 15,63.5 | U$2.8 17.62,63.62 17.5,63.5 | U$2.10 20.16,63.66 20,63.5 | U$2.12 22.7,63.7 22.5,63.5 | U$1.4 51.54,64.46 52.5,63.5 54,63.5 | 54,63.5 56.5,63.5 | 56.5,63.5 59,63.5 | 59,63.5 61.5,63.5 | 61.5,63.5 63.74,63.5 64.24,64 | U$1.6 54.08,63.58 54,63.5 | U$1.8 56.62,63.62 56.5,63.5 | U$1.10 59.16,63.66 59,63.5 | U$1.12 61.7,63.7 61.5,63.5
  Top 0.61: v51,19 52,19 | IC2.54 54,13.5 53.75,13.75 53,13.75 | IC2.58 58,13.5 58.25,13.75 59,13.75 | 59,13.75 61,13.75 | 61,13.75 62,13.75 | 62,13.75 63,13.75 | 63,13.75 64,13.75 | 64,13.75 64.75,13.75 65,13.5 IC2.65 | IC2.59 59,13.75 | IC2.61 61,13.75 | IC2.62 62,13.75 | IC2.63 63,13.75 | IC2.64 64,13.75
  Top 0.813: C13.P$2 53,8.8 IC2.53 53,13.75 53,14 52,15 52,19 52,20 | 52,20 50.5,20 | 50.5,20 IC2.46 | IC2.39 51,27 52,26 | 52,26 52,20 | IC2.29 57,29.5 56.75,29.25 53.5,26 52,26 | IC2.45 50,21 50.5,20.5 50.5,20 | U$2.14 U$2.13 25.24,58.89 C20.C 24.35,55.3 C18.2 25,54.35 IC3.1 | C24.C 27.15,43.8 C25.2 C28.2 C29.2
  Top 1.016: 47.35,4.15 49.1,2.4 J2.GND@1 | C7.2 C9.2 63.85,4.15 64,4 | J2.GND@2 63.1,4
  Top 1.27: C13.P$2 47.35,4.15 47.2,4 U$10.P$1 | 63.1,4 64,4 U$11.P$1 75,6 75,19 78,22 79.5,22 80,22 92,22 94.75,24.75 C8.- | IC1.3 95.5,51.5 97,53 97,65 95,67 74.5,67 73,65.5 | U$2.14 25.24,65.74 26.5,67 32.5,67 34,65.5 34,48.5 32.23,46.73 U$3.1 30.66,47 C24.C | 23.5,67 7,67 1,61 v1,43
  Top 1.422: U$1.13 64.24,64 U$1.14 64.24,65.74 | U$9.P$1 73,65.5 71.5,67 65.5,67 64.24,65.74 | D3.A 74.3,49.26 C2.2 | 64.24,65.74 62.98,67 44.5,67 43,65.5 U$8.P$1 41,62 41,47.5 41,27 41,6 U$10.P$1 | IC1.5 92.1,48.1 95.5,51.5 | 23.5,67 25.5,65 25.5,64.8 U$2.14
  Bottom 0.254: v73.25,32.5 73.25,37.75 v74,38.5 | R9.2 84.35,53.85 80.5,50 75.04,50 C2.2 | v20.5,21.5 20.5,24 | Q2.2 20.5,15.85 v20.5,21.5 | 15,31 v15,33.5 16.5,35 17,35 18.35,36.35 | 21.3,28.8 21,28.5 | R16.2 19.5,39.8 v17.8,41.5 20.25,41.5 21.75,43 v22.25,43 | v24.5,29 21,29 | C23.1 26.15,30.65 v24.5,29 | C26.1 C27.1 29.35,28.15 28.5,29 v28,29 v24.5,29 | v17,21 20,21 v20.5,21.5 | 14.15,25 13.95,24.8 12,24.8 v11.7,24.5
  Bottom 0.305: C6.2 58.35,28.15 v58,28.5 | R16.2 18.35,36.35 | 21.2,29.3 21,29.5
  Bottom 0.406: J1.GND 73.43,48.39 C2.2
  Bottom 0.61: C15.2 51,15.75 v51,19
  Bottom 0.813: C14.2 C15.2 | C19.2 14.15,25 14.15,24.85 15,24 17.35,24 C17.2 | C19.2 14.15,30.15 15,31 17.35,31 | 17.35,31 C21.2 | 17.35,31 20.5,31 21,30.5 21,29.5 21,29 21,28.5 21,27.65 | 21,27.65 C22.2 | 21,27.65 21,24.5 20.5,24 17.5,24 | JP5.4 16.12,1.62 | 16.12,1.62 15.25,0.75 6,0.75 4,2.75 U$5.P$1 | U$7.P$1 34,1.5 33.25,0.75 24.75,0.75 24,1.5 | 16.12,1.62 16.99,0.75 23.25,0.75 24,1.5 | v1,43 1,38 11.5,27.5 C19.2 | 24,1.5 24,3.42 JP3.3
  Bottom 1.422: U$9.P$1 70.3,61.3 D2.A 70.3,54.66 C2.2
  other vias: 6.5,60 6.5,56 5,48 5,41 11.5,58.5 13.5,58.5 15.5,58.5 18,58.5 21.5,60 13.5,48 21,52.5 21,48 33.5,58.5 33.5,51.5 26,25 34,11 45,53.5 45,42.5 43.5,9 66.5,15.5 48,3 53,3 67,3 75.5,9 75.5,14.5 75.5,20 75.5,25 90.5,26.5 90.5,32.5 81,38.5 90.5,38.5 83,45.5 75,45 67,45 56.5,49.5 56.5,53.5 65.5,58 67,53.5 77.5,61.5 93.5,53.5 93.5,50 9,11 15.5,16 12.5,11 12.5,19 23,7.5
  cutout Top: 57.5,0 62.5,0 62.5,5.5 64.5,5.5 64.5,18.5 57.5,18.5
  pour Top: 0,68 0,0 98,0 98,68
  pour Bottom: 0,68 98,68 98,0 0,0
MCU_CTS  (via drill 0.5)
  Top 0.254: IC4.10 23.2,29.2 v24.5,30.5
  Bottom 0.254: R17.1 23,42 21.5,40.5 21.5,33 24,30.5 v24.5,30.5
MCU_LED
  Top 0.254: IC4.32 10.7,26.7 9.5,25.5 7.5,25.5 6.5,26.5 R25.1
MCU_RX  (via drill 0.5)
  Top 0.254: IC4.13 20.38,33.88 v23.5,37
  Bottom 0.254: v23.5,37 R18.1
MCU_TX  (via drill 0.5)
  Top 0.254: IC4.12 22.7,30.2 v24.5,32
  Bottom 0.254: v24.5,32 24.5,32.75 22.5,34.75 22.5,39 23.25,39.75 25.9,39.75 R19.1
N$1
  Top 0.254: IC4.1 22.5,24.33 D4.1
N$2
  Top 0.254: IC4.5 22.8,26.7 23.5,26 23.5,25.26 Y1.1
  Bottom 0.254: R29.2 24.61,24.15 Y1.1 27.59,23.75 C26.2
N$3
  Top 0.254: IC4.6 25.96,27.2 Y1.2
  Bottom 0.254: R29.1 24.61,25.85 Y1.2 27.65,26.19 C27.2
N$4  (via drill 0.5)
  Top 0.254: IC4.7 24.45,27.7 26.85,30.1 26.85,32.75 | 26.85,32.75 R27.1 | v27.75,32.75 26.85,32.75
  Bottom 0.254: C23.2 27.85,32.85 v27.75,32.75
N$5
  Top 0.254: IC4.44 18.38,19.53 R26.2 17.85,15.19 JP4.2
N$6
  Top 0.254: U$3.20 U$3.19 32.65,22.15 R24.1
  Bottom 0.254: U$3.8 35.69,37.81 37,36.5 37,24.8 U$3.20
N$7
  Bottom 1.27: JP1.2 81.46,65.46 82.5,66.5 89,66.5 90,65.5 90,64.04 JP2.2
N$8
  Top 1.27: IC1.2 80.7,53.2 79,51.5 79,41.8 D3.C 80.7,43.5 91,43.5 95.4,39.1 L1.P$1
N$9  (via drill 0.5)  (1 unrouted)
  Top 1.27: IC1.1 80.1,54.9 v80,55 | C2.1 75.04,55 76.5,55
  Top 1.422: 76,55 76.5,55 v80,55
  Bottom 1.27: 75.5,58 D2.C | D1.C 75.5,58 | 75.5,58 75.5,56.5 v77,55 75,55
  Bottom 1.676: v77,55 v80,55
  other vias: 78.5,55
N$10
  Bottom 1.27: JP1.1 84,62.5 85,61.5 91.5,61.5 92.5,62.5 92.5,63.5 | 92.5,63.5 JP2.1 | F1.P$1 93.66,62.34 92.5,63.5
N$11  (via drill 0.5)
  Top 0.254: v85,50 84.8,49.8 IC1.4
  Bottom 0.254: C5.2 R10.2 | R10.2 87.85,50 v85,50 | R10.2 R9.1
N$12
  Bottom 0.254: R17.2 28.74,42.89 U$3.3
N$13
  Bottom 0.254: R19.2 28.7,40.35 U$3.5
N$14
  Top 0.254: LED1.C Q1.3
N$15
  Top 0.254: R24.2 35.5,19 37,20.5 37,33.04 U$3.10
N$16
  Top 0.61: IC2.60 R11.1
  Top 1.016: C7.1 60.05,8.3 R11.1
N$17  (via drill 0.5)
  Top 0.254: IC4.20 16.88,32.88 v17.5,33.5
  Bottom 0.254: v17.5,33.5 18.85,33.5 R16.1
N$18
  Top 1.016: J2.SIGNAL 60,6 | 60,6 R11.2 | C9.1 60,6
N$19
  Bottom 1.27: F1.P$2 D1.A
N$20  (via drill 0.5)
  Top 0.254: R2.2 v64,38 | v67.5,28 68,28.5 69.5,28.5 70,29 IC2.15
  Bottom 0.254: v64,38 64,31.5 v67.5,28
N$21
  Top 0.254: IC2.35 45.25,31 R14.1
N$22
  Top 0.254: R14.2 44.95,28.7 Q1.1
N$23
  Top 0.254: R15.1 LED1.A
N$24  (via drill 0.5)
  Top 0.406: v52,45.5 51,44.5 R7.2
  Bottom 0.406: J1.RST 53.62,47.12 v52,45.5
N$25  (via drill 0.5)
  Top 0.254: IC2.26 v60,32
  Bottom 0.254: v60,32 C6.1
N$26
  Top 1.27: 81.4,64 81.4,62.4 82.4,61.4 89.2,61.4 90,62.2 90,64
N$27
  Top 0.254: R25.2 4.7,32.05 Q3.1
N$29  (via drill 0.5)
  Top 0.254: R4.2 v66.5,38 | v69,29.5 69.5,30 IC2.16 73.65,30 C1.1
  Bottom 0.254: v66.5,38 66.5,32 v69,29.5
N$30  (via drill 0.5)
  Top 0.406: IC2.7 v62.5,21
  Bottom 0.406: v62.5,21 52.65,21 R5.2
N$33  (via drill 0.5)
  Top 0.406: IC2.8 v64.5,22
  Bottom 0.406: v64.5,22 54.15,22 R3.2
N$34  (via drill 0.5)
  Top 0.406: IC2.9 v66.5,23
  Bottom 0.406: v66.5,23 55.65,23 R1.2
N$35  (via drill 0.5)
  Top 0.406: C12.1 R12.1 v58.5,43
  Bottom 0.406: J1.IO 58.81,43.31 v58.5,43
N$36  (via drill 0.5)
  Top 0.406: v68.5,24 IC2.10
  Bottom 0.406: R6.2 57.15,24 v68.5,24
N$37
  Bottom 0.254: R21.1 19.5,5.54 JP3.2
N$38
  Bottom 0.254: R23.1 17,5.5 JP3.1
N$39  (via drill 0.5)
  Top 0.406: R8.2 54,42.5 | 54,42.5 C4.1 | v55,43.5 54,42.5
  Bottom 0.406: J1.CLK 56.08,44.58 v55,43.5
N$57
  Bottom 0.254: Q2.1 19.6,12.05 R20.2
N$58
  Bottom 0.254: SG1.+ 28.5,15.8 R22.1
N$59
  Bottom 0.254: SG1.- 28.35,9.25 Q2.3
N$60
  Bottom 0.254: R18.2 30.5,37 U$3.9
N$61
  Bottom 0.254: LED2.A 3.38,26.35 R28.1
N$62
  Top 0.254: Q3.3 1.9,30.37 LED2.K
SIM_CLK
  Top 0.406: R8.1 IC2.32
SIM_CTS_1  (via drill 0.5)
  Top 0.254: IC4.26 12.4,29.7 10.1,32 v10,32
  Bottom 0.254: U$2.1 v10,32
SIM_CTS_2
  Bottom 0.254: R5.1 48,32.35 48,61 U$1.1
SIM_DATA
  Top 0.406: R13.1 R12.2 55,37.15 IC2.31
SIM_PWR_1
  Top 0.254: IC4.29 10.3,28.2 8,30.5 8,63.5 9,64.5 9.96,64.5 U$2.2
SIM_PWR_2  (via drill 0.5)
  Top 0.254: 71,15 IC2.1 69.5,15 64.5,20 v60,20
  Bottom 0.254: v60,20 51,20 41.5,29.5 41.5,58 47.04,64.54 U$1.2
SIM_RESET_1
  Top 0.254: IC4.25 13.13,30.87 11,33 11,53 12.5,54.5 18,54.5 22.5,59 22.5,61.8 U$2.11
SIM_RESET_2
  Top 0.254: R4.1 64.5,43.35 64.5,53 61.7,55.8 U$1.11
SIM_RST
  Top 0.406: R7.1 53,37.65 IC2.33
SIM_RTS_1  (via drill 0.5)
  Top 0.254: IC4.27 11.8,29.2 v10.8,30
  Bottom 0.254: U$2.3 12.54,32.54 10.8,30.9 v10.8,30
SIM_RTS_2
  Bottom 0.254: R3.1 49,30.85 49,57.5 50.5,59 50.5,60.96 U$1.3
SIM_RX_1  (via drill 0.5)
  Top 0.254: IC4.21 16.38,36.38 v17,37
  Bottom 0.254: v17,37 17,38.5 16.5,39 16.5,60.88 U$2.7
SIM_RX_2
  Bottom 0.254: R6.1 51,31.85 51,55.5 56.62,61.12 U$1.7
SIM_TX_1  (via drill 0.5)
  Top 0.305: IC4.22 15.88,34.12 15,35 v14.5,35
  Bottom 0.254: v14.5,35 14.5,61.42 U$2.5
SIM_TX_2
  Bottom 0.254: R1.1 50,30.35 50,56.5 54.08,60.58 U$1.5
SIM_VDD  (via drill 0.5)
  Top 0.406: IC2.30 56,37 57,38 60.5,38 61.5,39 61.5,41.5 | 61.5,41.5 61.5,44.5 | 61.5,44.5 v61.5,49.5 | R13.2 60.15,41.5 61.5,41.5 | C3.2 61.15,44.5 61.5,44.5
  Bottom 0.406: v61.5,49.5 61.66,49.66 J1.VCC
SIM_VDDEXT_1
  Top 0.254: IC4.28 10.8,28.7 9,30.5 9,53 12,56 17,56 20.16,59.16 U$2.9
SIM_VDDEXT_2
  Top 0.254: R2.1 63,42.35 63,51.5 59.16,55.34 U$1.9
SWD_CLK
  Top 0.254: JP5.3 13.58,21.65 IC4.37
SWD_IO  (via drill 0.5)
  Top 0.254: IC4.34 11.7,25.7 7.5,21.5 v7.5,7
  Bottom 0.254: v7.5,7 7.54,7 JP5.2
TF_CLK
  Top 0.254: IC4.15 19.38,41.12 17.87,42.63 MICROSD.5
TF_CS  (via drill 0.5)
  Top 0.254: IC4.14 19.88,42.12 v19.5,42.5 | v18.5,46 16.77,46 MICROSD.2
  Bottom 0.254: v19.5,42.5 19.5,45 v18.5,46
TF_MISO
  Top 0.254: IC4.16 18.88,39.62 18.07,40.43 MICROSD.7
TF_MOSI
  Top 0.254: IC4.17 18.38,38.12 18,38.5 14.5,38.5 14,39 14,44 14.83,44.83 MICROSD.3
VCC  (via drill 0.5)
  Top 0.254: C11.1 77,34 | C10.1 79.5,34 | v47,13.5 46.15,13.5 R15.2 | L1.P$2 84.5,38.5 v82,41
  Top 0.61: v54.25,18 55.5,18 | v54.25,15.5 55.5,15.5 | IC2.55 55,13.5 55.5,14 | IC2.57 57,13.5 56.75,13.75 56,13.75
  Top 0.813: 55.5,14 56,14 56,13.75 IC2.56 56,7.2 C13.P$1
  Top 1.27: 81.1,34 79.5,34 77,34 71,34 70,33 | 70,33 55.5,18 55.5,15.5 55.5,14 | L1.P$2 81.1,34 | C8.+ 81.1,31.65 81.1,34 | U$1.16 U$1.15 70,59.28 70,33
  Bottom 0.254: C5.1 R10.1 88,47 v82,41 | v47,13.5 52,13.5 v54.25,15.5
  Bottom 0.61: C14.1 v54.25,18 | C15.1 52.95,15.5 v54.25,15.5

### Text on the board
tPlace: 2014-07-17 V0.3
tNames: V | IO | C | G | T | R | G | Update